# Altium project ctrl_6.PrjPcb
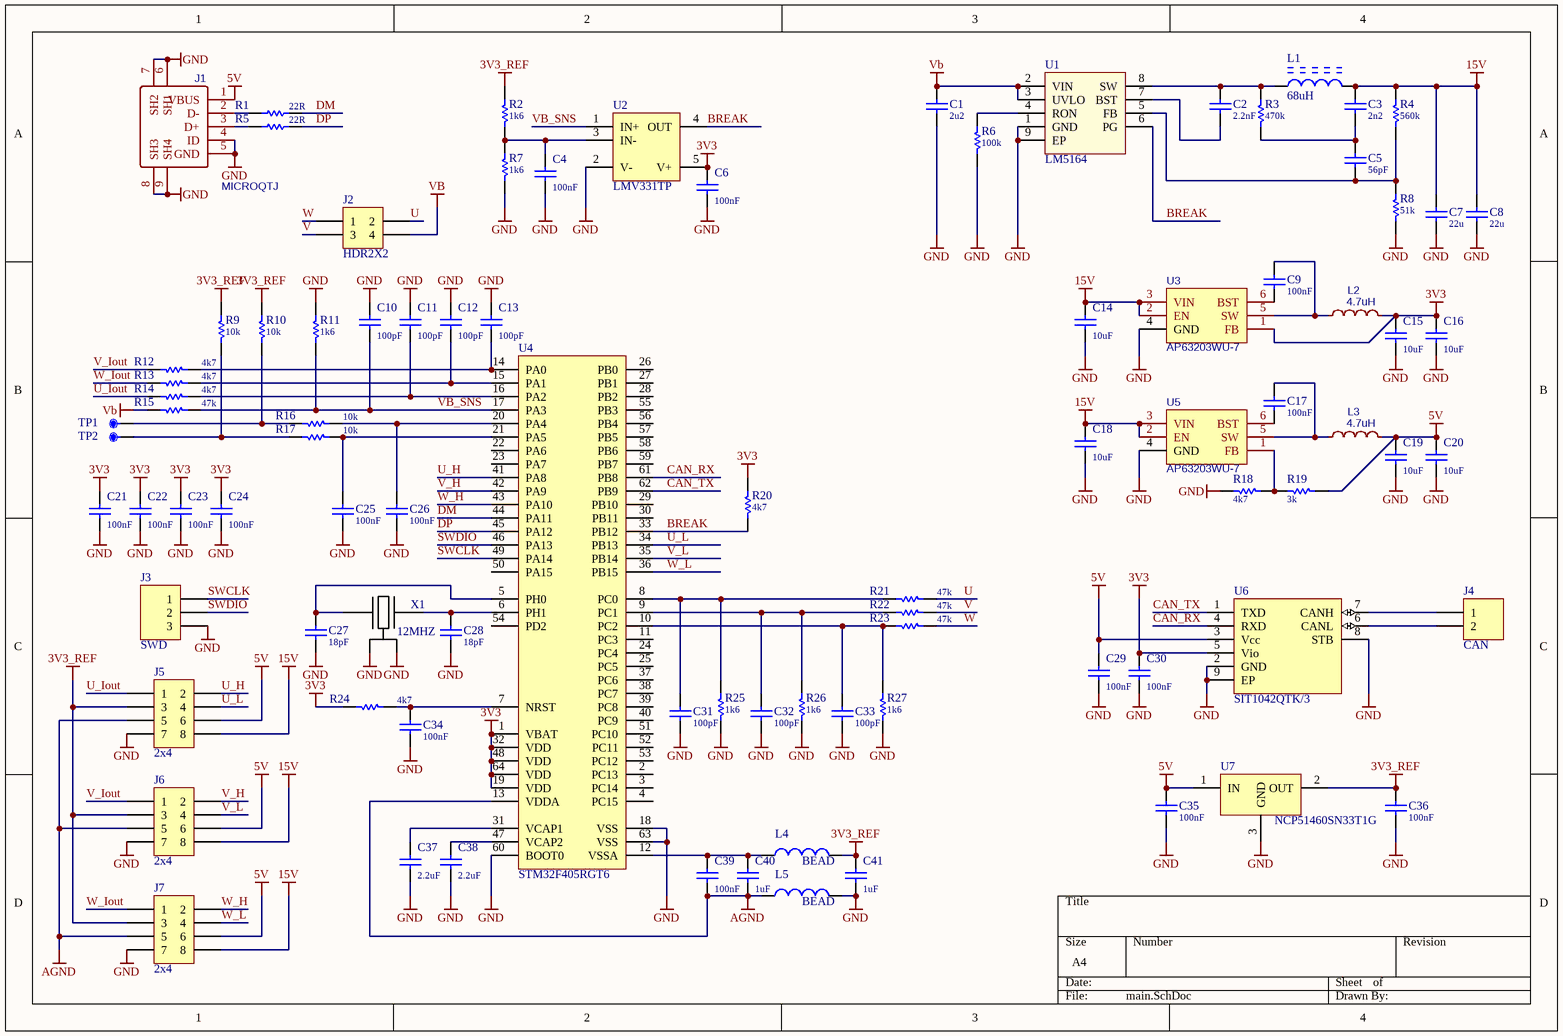
[diagram p0: main.SchDoc]
1 sheet, 90 parts. Net scope: global (net labels, ports and power ports of the same name join across sheets).
Board file: board.PcbDoc

## Sheet main.SchDoc: Main
size A4; Revision: 1; SheetNumber: 1; SheetTotal: 2

### Parts
C1  2u2  [C1210]
C2  2.2nF  [C0603]
C3  2n2  [C0603]
C4  100nF  [C0402]
C5  56pF  [C0603]
C6  100nF  [C0402]
C7  22u  [C1210]
C8  22u  [C1210]
C9  100nF  [C0402]
C10  100pF  [C0402]
C11  100pF  [C0402]
C12  100pF  [C0402]
C13  100pF  [C0402]
C14  10uF  [C1206]
C15  10uF  [C1206]
C16  10uF  [C1206]
C17  100nF  [C0402]
C18  10uF  [C1206]
C19  10uF  [C1206]
C20  10uF  [C1206]
C21  100nF  [C0402]
C22  100nF  [C0402]
C23  100nF  [C0402]
C24  100nF  [C0402]
C25  100nF  [C0402]
C26  100nF  [C0402]
C27  18pF  [C0402]
C28  18pF  [C0402]
C29  100nF  [C0402]
C30  100nF  [C0402]
C31  100pF  [C0402]
C32  100pF  [C0402]
C33  100pF  [C0402]
C34  100nF  [C0402]
C35  100nF  [C0402]
C36  100nF  [C0402]
C37  2.2uF  [C0603]
C38  2.2uF  [C0603]
C39  100nF  [C0402]
C40  1uF  [C0603]
C41  1uF  [C0603]
J1  MICROQTJ  [MICRO-USB-SMD_MICROQTJ]
J2  HDR2X2  [HDR-2X2]  (no BOM)
J3  SWD  [SWD]  (no BOM)
J4  CAN  [CONN-TH_22-05-7025]
J5  2x4  [HDR-2X4]
J6  2x4  [HDR-2X4]
J7  2x4  [HDR-2X4]
L1  68uH  [L0605-POWER]
L2  4.7uH  [IND-SMD_L4.4-W4.2]
L3  4.7uH  [IND-SMD_L4.4-W4.2]
L4  BEAD  [L0402]
L5  BEAD  [L0402]
R1  22R  [R0603]
R2  1k6  [R0603]
R3  470k  [R0603]
R4  560k  [R0603]
R5  22R  [R0603]
R6  100k  [R0603]
R7  1k6  [R0603]
R8  51k  [R0603]
R9  10k  [R0603]
R10  10k  [R0603]
R11  1k6  [R0603]
R12  4k7  [R0603]
R13  4k7  [R0603]
R14  4k7  [R0603]
R15  47k  [R1206]
R16  10k  [R0603]
R17  10k  [R0603]
R18  4k7  [R0603]
R19  3k  [R0603]
R20  4k7  [R0603]
R21  47k  [R1206]
R22  47k  [R1206]
R23  47k  [R1206]
R24  4k7  [R0603]
R25  1k6  [R0603]
R26  1k6  [R0603]
R27  1k6  [R0603]
TP1  (no value)  [TP2030_SMD]  (no BOM)
TP2  (no value)  [TP2030_SMD]  (no BOM)
U1  LM5164  [PowerSOIC-8]
U2  LMV331TP  [SOT-23-5]
U3  AP63203WU-7  [SOT-23-6]
U4  STM32F405RGT6  [LQFP-64]
U5  AP63203WU-7  [SOT-23-6]
U6  SIT1042QTK/3  [DFN8_3X3_P065]
U7  NCP51460SN33T1G  [SOT-23]
X1  12MHZ  [CRYSTAL_3.2x2.5mm]

### Nets
3V3: C6.2 C15.2 C16.2 C21.2 C22.2 C23.2 C24.2 C30.2 L2.2 R20.2 R24.1 U2.5(V+) U3.1(FB) U4.1(VBAT) U4.19(VDD) U4.32(VDD) U4.48(VDD) U4.64(VDD) U6.5(Vio)
3V3_REF: C36.2 C41.2 J5.3 J6.3 J7.3 L4.1 R2.1 R9.2 R10.2 U7.2(OUT)
5V: C19.2 C20.2 C29.2 C35.2 J1.1(VBUS) J5.6 J6.6 J7.6 L3.2 R19.1 U6.3(Vcc) U7.1(IN)
15V: C3.2 C7.2 C8.2 C14.2 C18.2 J5.8 J6.8 J7.8 L1.2 R4.1 U3.2(EN) U3.3(VIN) U5.2(EN) U5.3(VIN)
AGND: C39.1 C40.1 J5.5 J6.5 J7.5 L5.2 U4.13(VDDA)
GND: C1.1 C4.1 C6.1 C7.1 C8.1 C10.2 C11.2 C12.2 C13.2 C14.1 C15.1 C16.1 C18.1 C19.1 C20.1 C21.1 C22.1 C23.1 C24.1 C25.1 C26.1 C27.1 C28.1 C29.1 C30.1 C31.2 C32.2 C33.2 C34.1 C35.1 C36.1 C37.1 C38.1 C41.1 J1.4(ID) J1.5(GND) J1.6(SH1) J1.7(SH2) J1.8(SH3) J1.9(SH4) J3.3 J5.7 J6.7 J7.7 L5.1 R6.2 R7.2 R8.2 R11.2 R18.2 R25.2 R26.2 R27.2 U1.1(GND) U1.9(EP) U2.2(V-) U3.4(GND) U4.18(VSS) U4.60(BOOT0) U4.63(VSS) U5.4(GND) U6.2(GND) U6.8(STB) U6.9(EP) U7.3(GND) X1.2(GND) X1.4(GND)
Vb: C1.2 J2.4 R15.1 U1.2(VIN) U1.3(UVLO)
BREAK: R20.1 U1.6(PG) U2.4(OUT) U4.33(PB12)
CAN_RX: U4.61(PB8) U6.4(RXD)
CAN_TX: U4.62(PB9) U6.1(TXD)
DM: R1.1 U4.44(PA11)
DP: R5.1 U4.45(PA12)
SWCLK: J3.1 U4.49(PA14)
SWDIO: J3.2 U4.46(PA13)
U: J2.2 R21.2
U_H: J5.2 U4.41(PA8)
U_Iout: J5.1 R14.1
U_L: J5.4 U4.34(PB13)
V: J2.3 R22.2
V_H: J6.2 U4.42(PA9)
V_Iout: J6.1 R12.1
V_L: J6.4 U4.35(PB14)
VB_SNS: C10.1 R11.1 R15.2 U2.1(IN+) U4.17(PA3)
W: J2.1 R23.2
W_H: J7.2 U4.43(PA10)
W_Iout: J7.1 R13.1
W_L: J7.4 U4.36(PB15)
NetC2_1: C2.1 U1.7(BST)
NetC2_2: C2.2 L1.1 R3.1 U1.8(SW)
NetC3_1: C3.1 C5.2 R3.2
NetC4_2: C4.2 R2.2 R7.1 U2.3(IN-)
NetC5_1: C5.1 R4.2 R8.1 U1.5(FB)
NetC9_1: C9.1 U3.6(BST)
NetC9_2: C9.2 L2.1 U3.5(SW)
NetC11_1: C11.1 R14.2 U4.16(PA2)
NetC12_1: C12.1 R13.2 U4.15(PA1)
NetC13_1: C13.1 R12.2 U4.14(PA0)
NetC17_1: C17.1 U5.6(BST)
NetC17_2: C17.2 L3.1 U5.5(SW)
NetC25_2: C25.2 R17.1 U4.21(PA5)
NetC26_2: C26.2 R16.1 U4.20(PA4)
NetC27_2: C27.2 U4.5(PH0) X1.1(X1)
NetC28_2: C28.2 U4.6(PH1) X1.3(X2)
NetC31_1: C31.1 R21.1 R25.1 U4.8(PC0)
NetC32_1: C32.1 R22.1 R26.1 U4.9(PC1)
NetC33_1: C33.1 R23.1 R27.1 U4.10(PC2)
NetC34_2: C34.2 R24.2 U4.7(NRST)
NetC37_2: C37.2 U4.31(VCAP1)
NetC38_2: C38.2 U4.47(VCAP2)
NetC39_2: C39.2 C40.2 L4.2 U4.12(VSSA)
NetJ1_2: J1.2(D-) R1.2
NetJ1_3: J1.3(D+) R5.2
NetJ4_1: J4.1 U6.7(CANH)
NetJ4_2: J4.2 U6.6(CANL)
NetR6_1: R6.1 U1.4(RON)
NetR9_1: R9.1 R17.2 TP2.1
NetR10_1: R10.1 R16.2 TP1.1
NetR18_1: R18.1 R19.2 U5.1(FB)

Not connected (* = marked no-connect by the designer): U4 2(PC13) 3(PC14) 4(PC15) 11(PC3) 22(PA6) 23(PA7) 24(PC4) 25(PC5) 26(PB0) 27(PB1) 28(PB2) 29(PB10) 30(PB11) 37(PC6) 38(PC7) 39(PC8) 40(PC9) 50(PA15) 51(PC10) 52(PC11) 53(PC12) 54(PD2) 55(PB3) 56(PB4) 57(PB5) 58(PB6) 59(PB7)

### Library data of the parts
C1 = CAP: 2.2uF 100V 1210
C2 C37 C38 = CAP: 2.2uF 0603
C3 = CAP: 2.2nF 0603
C4 C6 C9-C13 C17 C21-C26 C29-C36 C39 = CAP: 100nF 0402
C5 = CAP: 56pF 0603
C7 C8 = CAP: 22u 35V 1210
C14-C16 C18-C20 = CAP: 10uF 1206
C27 C28 = CAP: 18pF 0402
C40 C41 = CAP: 1uF 0603
J2 = Header 2x2
J3 = Header 3
J4 = Header 3: 22057025
J5-J7 = Header 8
L1 = SRN3015-100M: PSPMAA0605H-680M-IGF
L2 L3 = 4.7uH: FXL0420-4R7-M
L4 L5 = BLM18AG601SN1D: BEAD 0402
R1 R5 = RES: 22R 0603
R2 R7 R11 R25-R27 = RES: 1k6 0603
R3 = RES: 470k 0603
R4 = RES: 560k 0603
R6 = RES: 100k 0603
R8 = RES: 51k 0603
R9 R10 R16 R17 = RES: 10k 0603
R12-R14 R18 R20 R24 = RES: 4k7 0603
R15 R21-R23 = RES: 47k 1206
R19 = RES: 3k 0603
TP1 TP2 = TP_Dup1
U4 = STM32F405: STM32 ARM-based 32-bit MCU
U6 = LTC2875
X1 = CRYSTAL 12MHZ 3.20mm x 2.50mm: X322512MOB4SI